# EAGLE design IA-prop-raspberry (EAGLE 6.6.0)
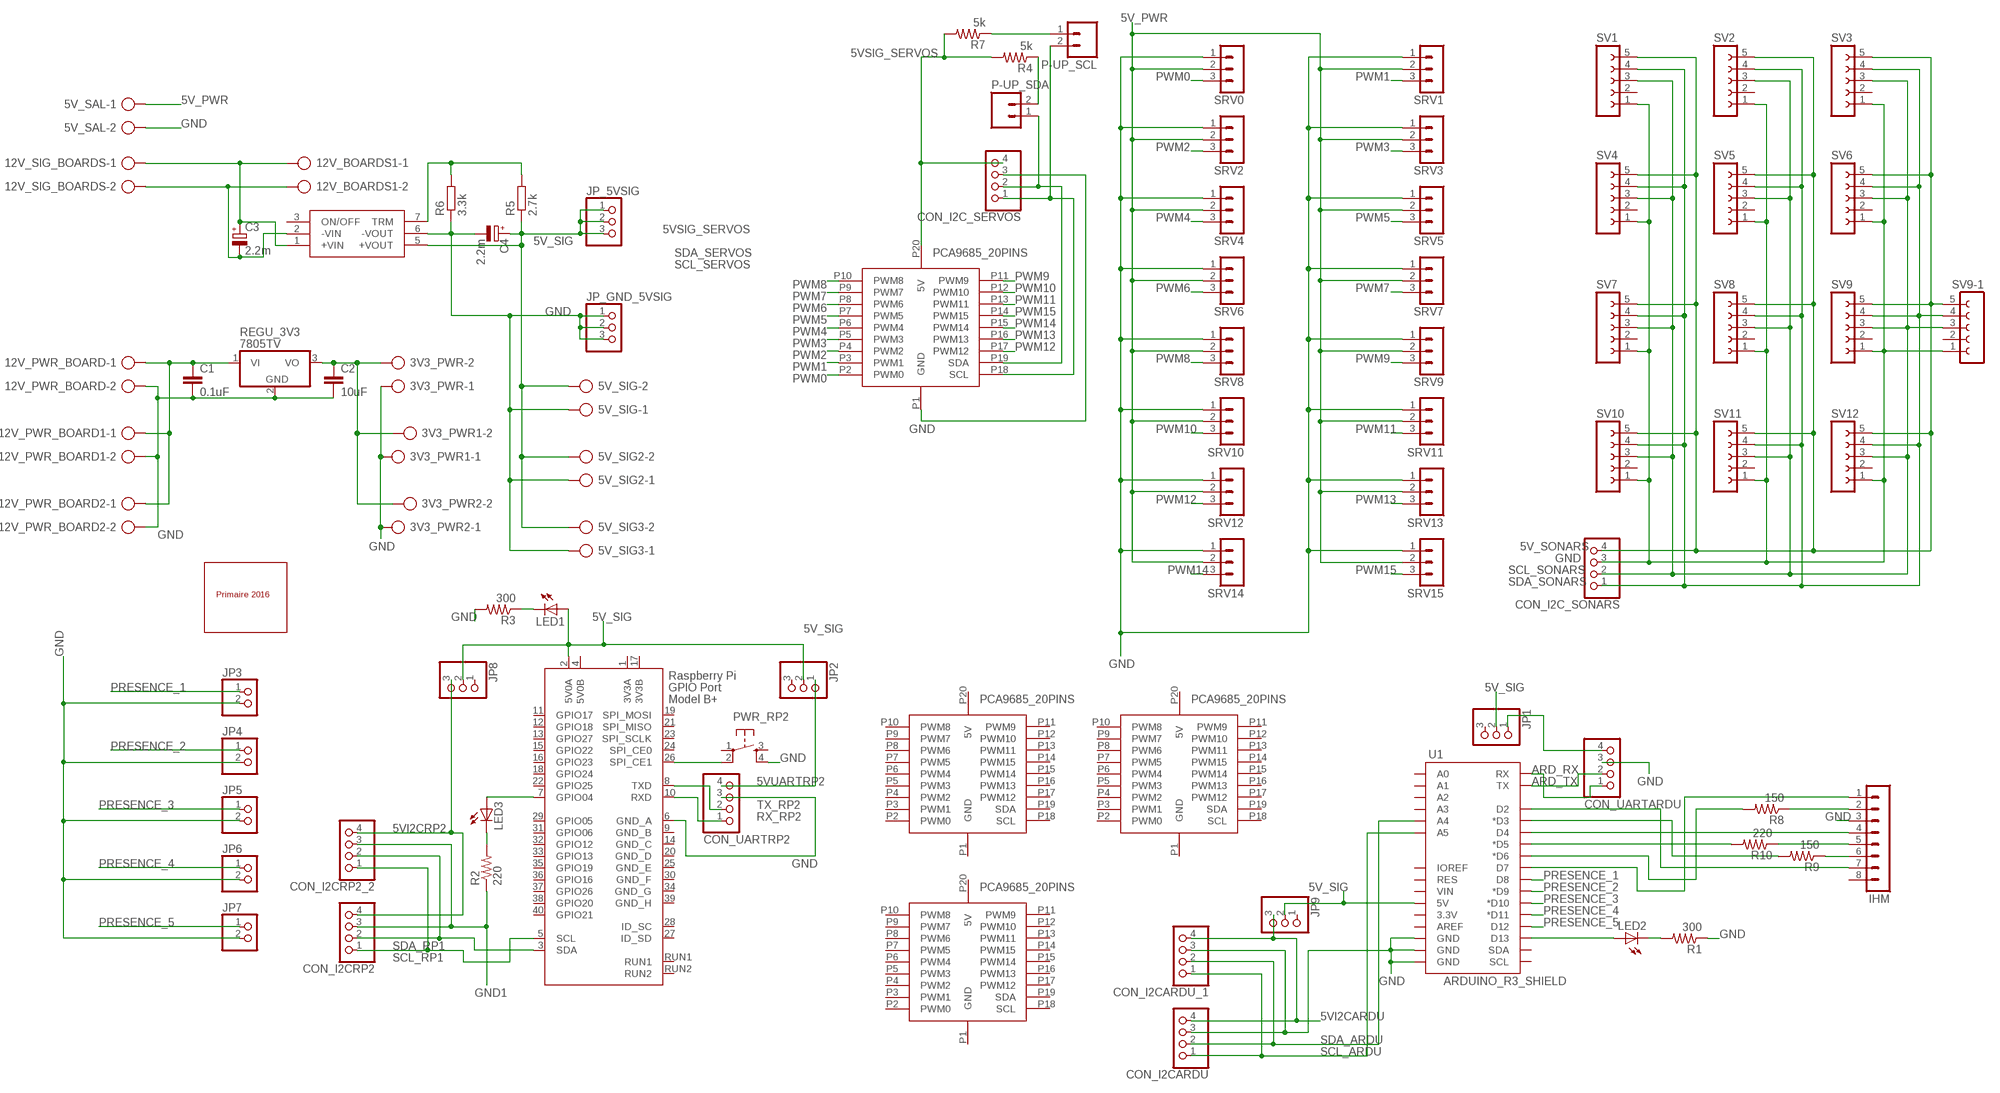
[diagram p0: schematic, sheet 1, part 1 of 2]
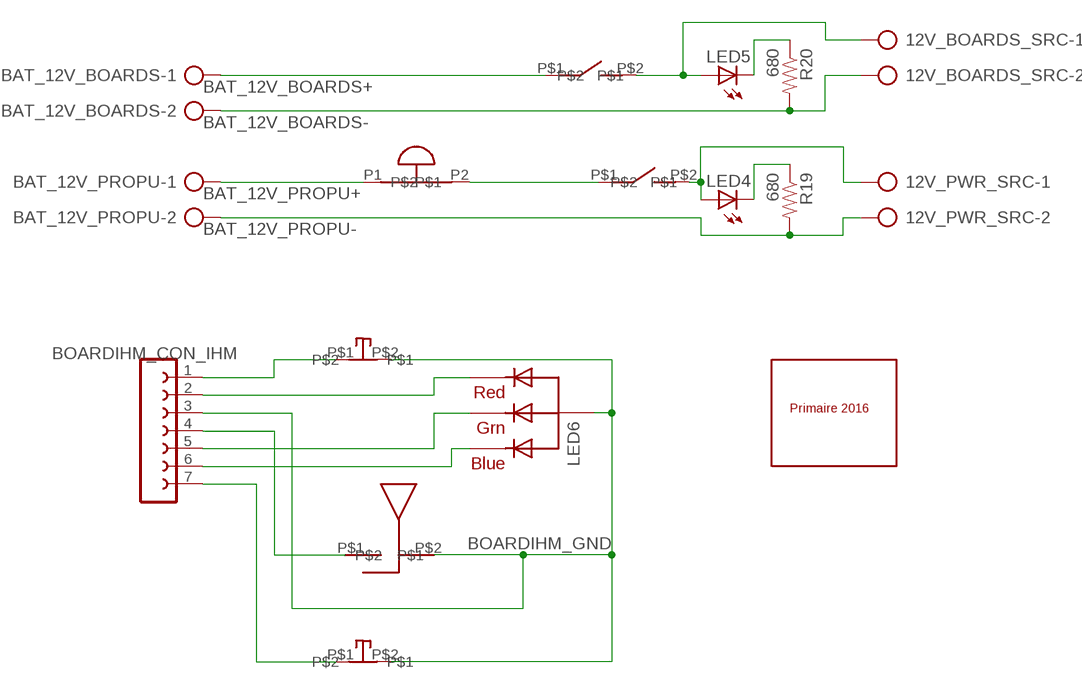
[diagram p1: schematic, sheet 1, part 2 of 2]

## Parts
3V3_PWR  AK300/2  [AK300/2]
3V3_PWR1  AK300/2  [AK300/2]
3V3_PWR2  AK300/2  [AK300/2]
5V_SAL  AK300/2  [AK300/2]
5V_SIG  AK300/2  [AK300/2]
5V_SIG2  AK300/2  [AK300/2]
5V_SIG3  AK300/2  [AK300/2]
12V_BOARDS1  AK300/2  [AK300/2]
12V_BOARDS_SRC  AK300/2  [AK300/2]
12V_PWR_BOARD  AK300/2  [AK300/2]
12V_PWR_BOARD1  AK300/2  [AK300/2]
12V_PWR_BOARD2  AK300/2  [AK300/2]
12V_PWR_SRC  AK300/2  [AK300/2]
12V_SIG_BOARDS  AK300/2  [AK300/2]
BAT_12V_BOARDS  AK300/2  [AK300/2]
BAT_12V_PROPU  AK300/2  [AK300/2]
BOARDIHM_CON_IHM  FE07-1  [FE07]
C1  0.1uF  C-EU050-025X075  [C050-025X075]
C2  10uF  C-EU050-025X075  [C050-025X075]
C3  2.2m  CPOL-EUE5-13  [E5-13]
C4  2.2m  CPOL-EUE5-13  [E5-13]
CON_I2C_SERVOS  PINHD-1X4  [1X04]
CON_I2C_SONARS  PINHD-1X4  [1X04]
CON_I2CARDU  PINHD-1X4  [1X04]
CON_I2CARDU_1  PINHD-1X4  [1X04]
CON_I2CRP2  PINHD-1X4  [1X04]
CON_I2CRP2_2  PINHD-1X4  [1X04]
CON_UARTARDU  PINHD-1X4  [1X04]
CON_UARTRP2  PINHD-1X4  [1X04]
IHM  MA08-1  [MA08-1]
JP1  PINHD-1X3  [1X03]
JP2  PINHD-1X3  [1X03]
JP3  PINHD-1X2  [1X02]
JP4  PINHD-1X2  [1X02]
JP5  PINHD-1X2  [1X02]
JP6  PINHD-1X2  [1X02]
JP7  PINHD-1X2  [1X02]
JP8  PINHD-1X3  [1X03]
JP9  PINHD-1X3  [1X03]
JP_5VSIG  PINHD-1X3  [1X03]
JP_GND_5VSIG  PINHD-1X3  [1X03]
LED1  LED3MM  [LED3MM]
LED2  LED3MM  [LED3MM]
LED3  LED3MM  [LED3MM]
LED4  LED5MM  [LED5MM]
LED5  LED5MM  [LED5MM]
LED6  RGBLED_CA-5MM  [LED5MMRGB]
P-UP_SCL  M02PTH  [1X02]
P-UP_SDA  M02PTH  [1X02]
PWR_RP2  TAC_SWITCHPTH  [TACTILE-PTH]
R1  300  RESISTORAXIAL-0.3  [AXIAL-0.3]
R2  220  RESISTORAXIAL-0.3  [AXIAL-0.3]
R3  300  RESISTORAXIAL-0.3  [AXIAL-0.3]
R4  5k  RESISTORAXIAL-0.3  [AXIAL-0.3]
R5  2.7k  R-EU_0207/7  [0207/7]
R6  3.3k  R-EU_0207/7  [0207/7]
R7  5k  RESISTORAXIAL-0.3  [AXIAL-0.3]
R8  150  RESISTORAXIAL-0.3  [AXIAL-0.3]
R9  150  RESISTORAXIAL-0.3  [AXIAL-0.3]
R10  220  RESISTORAXIAL-0.3  [AXIAL-0.3]
R19  680  RESISTORAXIAL-0.3  [AXIAL-0.3]
R20  680  RESISTORAXIAL-0.3  [AXIAL-0.3]
REGU_3V3  7805TV  [TO220V]
RP2  RASPI_BOARD_B+#_FP  [RASPI_BOARD_B+_FULL_PAD]
SRV0  MA03-1  [MA03-1]
SRV1  MA03-1  [MA03-1]
SRV2  MA03-1  [MA03-1]
SRV3  MA03-1  [MA03-1]
SRV4  MA03-1  [MA03-1]
SRV5  MA03-1  [MA03-1]
SRV6  MA03-1  [MA03-1]
SRV7  MA03-1  [MA03-1]
SRV8  MA03-1  [MA03-1]
SRV9  MA03-1  [MA03-1]
SRV10  MA03-1  [MA03-1]
SRV11  MA03-1  [MA03-1]
SRV12  MA03-1  [MA03-1]
SRV13  MA03-1  [MA03-1]
SRV14  MA03-1  [MA03-1]
SRV15  MA03-1  [MA03-1]
SV1  FE05-1  [FE05-1]
SV2  FE05-1  [FE05-1]
SV3  FE05-1  [FE05-1]
SV4  FE05-1  [FE05-1]
SV5  FE05-1  [FE05-1]
SV6  FE05-1  [FE05-1]
SV7  FE05-1  [FE05-1]
SV8  FE05-1  [FE05-1]
SV9  FE05-1  [FE05-1]
SV9-1  FE05-1  [FE05-1]
SV10  FE05-1  [FE05-1]
SV11  FE05-1  [FE05-1]
SV12  FE05-1  [FE05-1]
U1  ARDUINO_R3_SHIELD  [UNO_R3_SHIELD]
U$1  PCA9685_FEMALE  [2X10PINS_SPACE10MM]
U$2  TEN25-1211TEN25-1211  [TEN25]
U$3  FOOTPRINT_PRIMAIRE2016  [PRIMAIRE2016]
U$4  BAU  [BAU_30]
U$5  PCA9685_MALE  [TSSOP28_&_2X10PINS_SPACE10MM]
U$6  SWITCH_01  [SWITCH_01]
U$7  PCA9685_MALE  [TSSOP28_&_2X10PINS_SPACE10MM]
U$8  SWITCH_01  [SWITCH_01]
U$9  PUSH_BUT_COL_SELEC  [PUSH_BUT_COL_SELEC]
U$10  CORD  [CORD]
U$11  FOOTPRINT_PRIMAIRE2016  [PRIMAIRE2016]
U$12  PUSH_BUT_COL_SELEC  [PUSH_BUT_COL_SELEC]
U$13  PCA9685_MALE  [TSSOP28_&_2X10PINS_SPACE10MM]

## Nets
5V_PRP1: LED2.A U1.D13
5V_PWR: 5V_SAL.1 SRV0.2 SRV1.2 SRV2.2 SRV3.2 SRV4.2 SRV5.2 SRV6.2 SRV7.2 SRV8.2 SRV9.2 SRV10.2 SRV11.2 SRV12.2 SRV13.2 SRV14.2 SRV15.2
5V_SIG: 5V_SIG2.2 5V_SIG3.2 5V_SIG.2 C4.+ JP1.2 JP2.2 JP8.2 JP9.2 JP_5VSIG.1 JP_5VSIG.2 JP_5VSIG.3 LED1.A R5.1 RP2.2(5V0A) U1.5V U$2.5(+VOUT)
5V_SONARS: CON_I2C_SONARS.4 SV1.5 SV2.5 SV3.5 SV4.5 SV5.5 SV6.5 SV7.5 SV8.5 SV9-1.5 SV9.5 SV10.5 SV11.5 SV12.5
5VI2CARDU: CON_I2CARDU.4 CON_I2CARDU_1.4 JP9.3
5VI2CRP2: CON_I2CRP2.4 CON_I2CRP2_2.4 JP8.3
5VSIG_SERVOS: CON_I2C_SERVOS.4 R4.P$2 R7.P$2 U$1.P20(5V)
5VUARTRP2: CON_UARTRP2.4 JP2.1
+12V: 12V_BOARDS1.1 12V_SIG_BOARDS.1 C3.+ U$2.1(+VIN)
ARD_RX: CON_UARTARDU.1 U1.RX
ARD_TX: CON_UARTARDU.2 U1.TX
BAT_12V_BOARDS+: BAT_12V_BOARDS.1 U$8.P$1
BAT_12V_BOARDS-: 12V_BOARDS_SRC.2 BAT_12V_BOARDS.2 R20.P$2
BAT_12V_PROPU+: BAT_12V_PROPU.1 U$4.P1
BAT_12V_PROPU-: 12V_PWR_SRC.2 BAT_12V_PROPU.2 R19.P$2
BOARDIHM_GND: BOARDIHM_CON_IHM.3 LED6.2(VCC) U$9.P$2 U$10.P$2 U$12.P$2
GND: 3V3_PWR1.1 3V3_PWR2.1 3V3_PWR.1 5V_SAL.2 5V_SIG2.1 5V_SIG3.1 5V_SIG.1 12V_PWR_BOARD1.2 12V_PWR_BOARD2.2 12V_PWR_BOARD.2 C1.2 C2.2 C4.- CON_I2C_SERVOS.3 CON_I2C_SONARS.3 CON_I2CARDU.3 CON_I2CARDU_1.3 CON_UARTARDU.3 CON_UARTRP2.3 IHM.3 JP3.2 JP4.2 JP5.2 JP6.2 JP7.2 JP_GND_5VSIG.1 JP_GND_5VSIG.2 JP_GND_5VSIG.3 PWR_RP2.4 R1.P$1 R3.P$2 R6.1 REGU_3V3.2(GND) RP2.6(GND_A) SRV0.1 SRV1.1 SRV2.1 SRV3.1 SRV4.1 SRV5.1 SRV6.1 SRV7.1 SRV8.1 SRV9.1 SRV10.1 SRV11.1 SRV12.1 SRV13.1 SRV14.1 SRV15.1 SV1.1 SV2.1 SV3.1 SV4.1 SV5.1 SV6.1 SV7.1 SV8.1 SV9-1.1 SV9.1 SV10.1 SV11.1 SV12.1 U1.GND@0(GND) U1.GND@1(GND) U1.GND@2(GND) U$1.P1(GND) U$2.6(-VOUT)
GND1: CON_I2CRP2.3 CON_I2CRP2_2.3 R2.P$1
GND_12: 12V_BOARDS1.2 12V_SIG_BOARDS.2 C3.- U$2.2(-VIN)
N$1: CON_UARTARDU.4 JP1.1
N$2: LED2.K(C) R1.P$2
N$3: LED3.K(C) R2.P$2
N$4: R5.2 R6.2 U$2.7(TRM)
N$5: P-UP_SDA.2 R4.P$1
N$6: BOARDIHM_CON_IHM.1 U$9.P$1
N$7: LED1.K(C) R3.P$1
N$8: U$4.P2 U$6.P$1
N$9: P-UP_SCL.1 R7.P$1
N$12: LED4.K(C) R19.P$1
N$14: 12V_BOARDS_SRC.1 LED5.A U$8.P$2
N$15: BOARDIHM_CON_IHM.2 LED6.1(RED)
N$16: LED5.K(C) R20.P$1
N$17: R9.P$2 U1.D3(*D3)
N$18: BOARDIHM_CON_IHM.4 U$10.P$1
N$39: R10.P$2 U1.D5(*D5)
N$40: 12V_PWR_SRC.1 LED4.A U$6.P$2
N$41: IHM.6 R9.P$1
N$42: LED3.A RP2.7(GPIO04)
N$43: IHM.5 R10.P$1
N$44: IHM.2 R8.P$1
N$45: R8.P$2 U1.D6(*D6)
N$46: IHM.1 U1.D7
N$47: IHM.4 U1.D4
N$49: IHM.7 U1.D2
N$51: BOARDIHM_CON_IHM.5 LED6.3(GREEN)
N$52: BOARDIHM_CON_IHM.6 LED6.4(BLUE)
N$72: 3V3_PWR1.2 3V3_PWR2.2 3V3_PWR.2 C2.1 REGU_3V3.3(VO)
N$73: BOARDIHM_CON_IHM.7 U$12.P$1
N$74: 12V_PWR_BOARD1.1 12V_PWR_BOARD2.1 12V_PWR_BOARD.1 C1.1 REGU_3V3.1(VI)
PRESENCE_1: JP3.1 U1.D8
PRESENCE_2: JP4.1 U1.D9(*D9)
PRESENCE_3: JP5.1 U1.D10(*D10)
PRESENCE_4: JP6.1 U1.D11(*D11)
PRESENCE_5: JP7.1 U1.D12
PWM0: SRV0.3 U$1.P2(PWM0)
PWM1: SRV1.3 U$1.P3(PWM1)
PWM2: SRV2.3 U$1.P4(PWM2)
PWM3: SRV3.3 U$1.P5(PWM3)
PWM4: SRV4.3 U$1.P6(PWM4)
PWM5: SRV5.3 U$1.P7(PWM5)
PWM6: SRV6.3 U$1.P8(PWM6)
PWM7: SRV7.3 U$1.P9(PWM7)
PWM8: SRV8.3 U$1.P10(PWM8)
PWM9: SRV9.3 U$1.P11(PWM9)
PWM10: SRV10.3 U$1.P12(PWM10)
PWM11: SRV11.3 U$1.P13(PWM11)
PWM12: SRV12.3 U$1.P17(PWM12)
PWM13: SRV13.3 U$1.P16(PWM13)
PWM14: SRV14.3 U$1.P15(PWM14)
PWM15: SRV15.3 U$1.P14(PWM15)
RP2_PWR: PWR_RP2.2 RP2.26(SPI_CE1)
RX_RP2: CON_UARTRP2.1 RP2.10(RXD)
SCL_ARDU: CON_I2CARDU.1 CON_I2CARDU_1.1 U1.A5
SCL_RP1: CON_I2CRP2.1 CON_I2CRP2_2.1 RP2.5(SCL)
SCL_SERVOS: CON_I2C_SERVOS.1 P-UP_SCL.2 U$1.P18(SCL)
SCL_SONARS: CON_I2C_SONARS.2 SV1.3 SV2.3 SV3.3 SV4.3 SV5.3 SV6.3 SV7.3 SV8.3 SV9-1.3 SV9.3 SV10.3 SV11.3 SV12.3
SDA_ARDU: CON_I2CARDU.2 CON_I2CARDU_1.2 U1.A4
SDA_RP1: CON_I2CRP2.2 CON_I2CRP2_2.2 RP2.3(SDA)
SDA_SERVOS: CON_I2C_SERVOS.2 P-UP_SDA.1 U$1.P19(SDA)
SDA_SONARS: CON_I2C_SONARS.1 SV1.4 SV2.4 SV3.4 SV4.4 SV5.4 SV6.4 SV7.4 SV8.4 SV9-1.4 SV9.4 SV10.4 SV11.4 SV12.4
TX_RP2: CON_UARTRP2.2 RP2.8(TXD)
Unconnected: IHM.8 JP1.3 JP2.3 JP8.1 JP9.1 PWR_RP2.1 PWR_RP2.3 RP2.11(GPIO17) RP2.12(GPIO18) RP2.13(GPIO27) RP2.15(GPIO22) RP2.16(GPIO23) RP2.18(GPIO24) RP2.19(SPI_MOSI) RP2.21(SPI_MISO) RP2.22(GPIO25) RP2.23(SPI_SCLK) RP2.24(SPI_CE0) RP2.27(ID_SD) RP2.28(ID_SC) RP2.29(GPIO05) RP2.31(GPIO06) RP2.32(GPIO12) RP2.33(GPIO13) RP2.35(GPIO19) RP2.36(GPIO16) RP2.37(GPIO26) RP2.38(GPIO20) RP2.40(GPIO21) RP2.RUN1 RP2.RUN2 SV1.2 SV2.2 SV3.2 SV4.2 SV5.2 SV6.2 SV7.2 SV8.2 SV9-1.2 SV9.2 SV10.2 SV11.2 SV12.2 U1.3.3V U1.A0 U1.A1 U1.A2 U1.A3 U1.AREF U1.IOREF U1.RES U1.SCL U1.SDA U1.VIN U$2.3(ON/OFF) U$5.P1(GND) U$5.P2(PWM0) U$5.P3(PWM1) U$5.P4(PWM2) U$5.P5(PWM3) U$5.P6(PWM4) U$5.P7(PWM5) U$5.P8(PWM6) U$5.P9(PWM7) U$5.P10(PWM8) U$5.P11(PWM9) U$5.P12(PWM10) U$5.P13(PWM11) U$5.P14(PWM15) U$5.P15(PWM14) U$5.P16(PWM13) U$5.P17(PWM12) U$5.P18(SCL) U$5.P19(SDA) U$5.P20(5V) U$7.P1(GND) U$7.P2(PWM0) U$7.P3(PWM1) U$7.P4(PWM2) U$7.P5(PWM3) U$7.P6(PWM4) U$7.P7(PWM5) U$7.P8(PWM6) U$7.P9(PWM7) U$7.P10(PWM8) U$7.P11(PWM9) U$7.P12(PWM10) U$7.P13(PWM11) U$7.P14(PWM15) U$7.P15(PWM14) U$7.P16(PWM13) U$7.P17(PWM12) U$7.P18(SCL) U$7.P19(SDA) U$7.P20(5V) U$13.P1(GND) U$13.P2(PWM0) U$13.P3(PWM1) U$13.P4(PWM2) U$13.P5(PWM3) U$13.P6(PWM4) U$13.P7(PWM5) U$13.P8(PWM6) U$13.P9(PWM7) U$13.P10(PWM8) U$13.P11(PWM9) U$13.P12(PWM10) U$13.P13(PWM11) U$13.P14(PWM15) U$13.P15(PWM14) U$13.P16(PWM13) U$13.P17(PWM12) U$13.P18(SCL) U$13.P19(SDA) U$13.P20(5V)

## Power pins joined to a net without a drawn wire
3V3A: RP2.1(3V3A)
3V3B: RP2.17(3V3B)
5V0B: RP2.4(5V0B)
GND_B: RP2.9(GND_B)
GND_C: RP2.14(GND_C)
GND_D: RP2.20(GND_D)
GND_E: RP2.25(GND_E)
GND_F: RP2.30(GND_F)
GND_G: RP2.34(GND_G)
GND_H: RP2.39(GND_H)

## Library data of the parts
3V3_PWR 3V3_PWR1 3V3_PWR2 5V_SAL 5V_SIG 5V_SIG2 5V_SIG3 12V_BOARDS1 12V_BOARDS_SRC 12V_PWR_BOARD 12V_PWR_BOARD1 12V_PWR_BOARD2 12V_PWR_SRC 12V_SIG_BOARDS BAT_12V_BOARDS BAT_12V_PROPU = con-ptr500:AK300/2: CONNECTOR; OC_FARNELL: unknown; OC_NEWARK: unknown
BOARDIHM_CON_IHM = con-lsta:FE07-1: FEMALE HEADER; OC_FARNELL: unknown; OC_NEWARK: unknown
C1 C2 = rcl:C-EU: CAPACITOR, European symbol
C3 C4 = resistor:CPOL-EU: POLARIZED CAPACITOR, European symbol
CON_I2C_SERVOS CON_I2C_SONARS CON_I2CARDU CON_I2CARDU_1 CON_I2CRP2 CON_I2CRP2_2 CON_UARTARDU CON_UARTRP2 = pinhead:PINHD-1X4: PIN HEADER
IHM = con-lstb:MA08-1: PIN HEADER
JP1 JP2 JP8 JP9 JP_5VSIG JP_GND_5VSIG = pinhead:PINHD-1X3: PIN HEADER
JP3-JP7 = pinhead:PINHD-1X2: PIN HEADER
LED1-LED3 = SparkFun:LED: LEDs Standard schematic elements and footprints for 5mm, 3mm, 1206, and 0603 sized LEDs. 5mm - Spark Fun Electronics SKU : COM-00529 (and others)
LED4 LED5 = adafruit:LED: LED OSRAM: - CHIPLED LG R971, LG N971, LY N971, LG Q971, LY Q971, LO R971, LY R971 LH N974, LH R974 LS Q976, LO Q976, LY Q976 LO Q996 - Hyper CHIPLED LW Q18S LB Q993, LB Q99A, LB R99A - SideLED LS A670, LO A670, LY A670, LG A670, LP A670 LB A673, LV A673, LT A673, LW A673 LH A674 LY A675 LS A676, LA A676, LO A676, LY A676, LW A676 LS A679, LY A679, LG A679 - Hyper Micro SIDELED® LS Y876, LA Y876, LO Y876, LY Y876 LT Y87S - SmartLED LW L88C, LW L88S LB L89C, LB L89S, LG L890 LS L89K, LO L89K, LY L89K LS L896, LA L896, LO L896, LY L896 - TOPLED LS T670, LO T670, LY T670, LG T670, LP T670 LSG T670, LSP T670, LSY T670, LOP T670, LYG T670 LG T671, LOG T671, LSG T671 LB T673, LV T673, LT T673, LW T673 LH T674 LS T676, LA T676, LO T676, LY T676, LB T676, LH T676, LSB T676, LW T676 LB T67C, LV T67C, LT T67C, LS T67K, LO T67K, LY T67K, LW E67C LS E67B, LA E67B, LO E67B, LY E67B, LB E67C, LV E67C, LT E67C LW T67C LS T679, LY T679, LG T679 LS T770, LO T770, LY T770, LG T770, LP T770 LB T773, LV T773, LT T773, LW T773 LH T774 LS E675, LA E675, LY E675, LS T675 LS T776, LA T776, LO T776, LY T776, LB T776 LHGB T686 LT T68C, LB T68C - Hyper Mini TOPLED® LB M676 - Mini TOPLED Santana® LG M470 LS M47K, LO M47K, LY M47K Source: http://www.osram.convergy.de/
LED6 = adafruit:RGBLED_CA: RGB LED, common-anode 5MM Staggered pins 5mm Piranha package http://www.ladyada.net/library/pcb/eaglelibrary.html
P-UP_SCL P-UP_SDA = SparkFun:M02: Header 2 Standard 2-pin 0.1" header. Use with straight break away headers (SKU : PRT-00116), right angle break away headers (PRT-00553), swiss pins (PRT-00743), machine pins (PRT-00117), and female headers (PRT-00115). Molex polarized connector foot print use with SKU : PRT-08233 with associated crimp pins and housings.
PWR_RP2 = SparkFun:TAC_SWITCH: Momentary Switch Button commonly used for reset or general input. Spark Fun Electronics SKU : COM-00097
R1-R4 R7-R10 R19 R20 = SparkFun:RESISTOR: Resistor Basic schematic elements and footprints for 0603, 1206, and PTH resistors.
R5 R6 = resistor:R-EU_: RESISTOR, European symbol
REGU_3V3 = linear:78*: Positive VOLTAGE REGULATOR Source: http://cache.national.com/ds/LM/LM78L05.pdf http://www.fairchildsemi.com/ds/LM/LM7805.pdf
RP2 = raspberrypi_bastelstube_v13-enac:RASPI_BOARD_B+#: Raspberry Pi GPIO connector with markings for the outer dimensions of the Raspberry Pi board model B+ with different sets of drill holes or mounting pads All pins connected
SRV0 SRV1-SRV15 = con-lstb:MA03-1: PIN HEADER
SV1-SV9 SV9-1 SV10-SV12 = con-lsta:FE05-1: FEMALE HEADER; OC_FARNELL: unknown; OC_NEWARK: unknown
U1 = SparkFun-Boards:ARDUINO_R3_SHIELD: Shield form compatible with the Arduino Uno R3.
U$1 = club:PCA9685_FEMALE: PCA9685_20PINS_FEMALE
U$2 = tracopower:TEN25-1211
U$3 U$11 = footprintPrimaire2016:FOOTPRINT_PRIMAIRE2016
U$4 = club:BAU
U$5 U$7 U$13 = club:PCA9685_MALE: PCA9685_20PINS_MALE
U$6 U$8 = club:SWITCH_01
U$9 U$12 = club:PUSH_BUT_COL_SELEC
U$10 = club:CORD

## Board
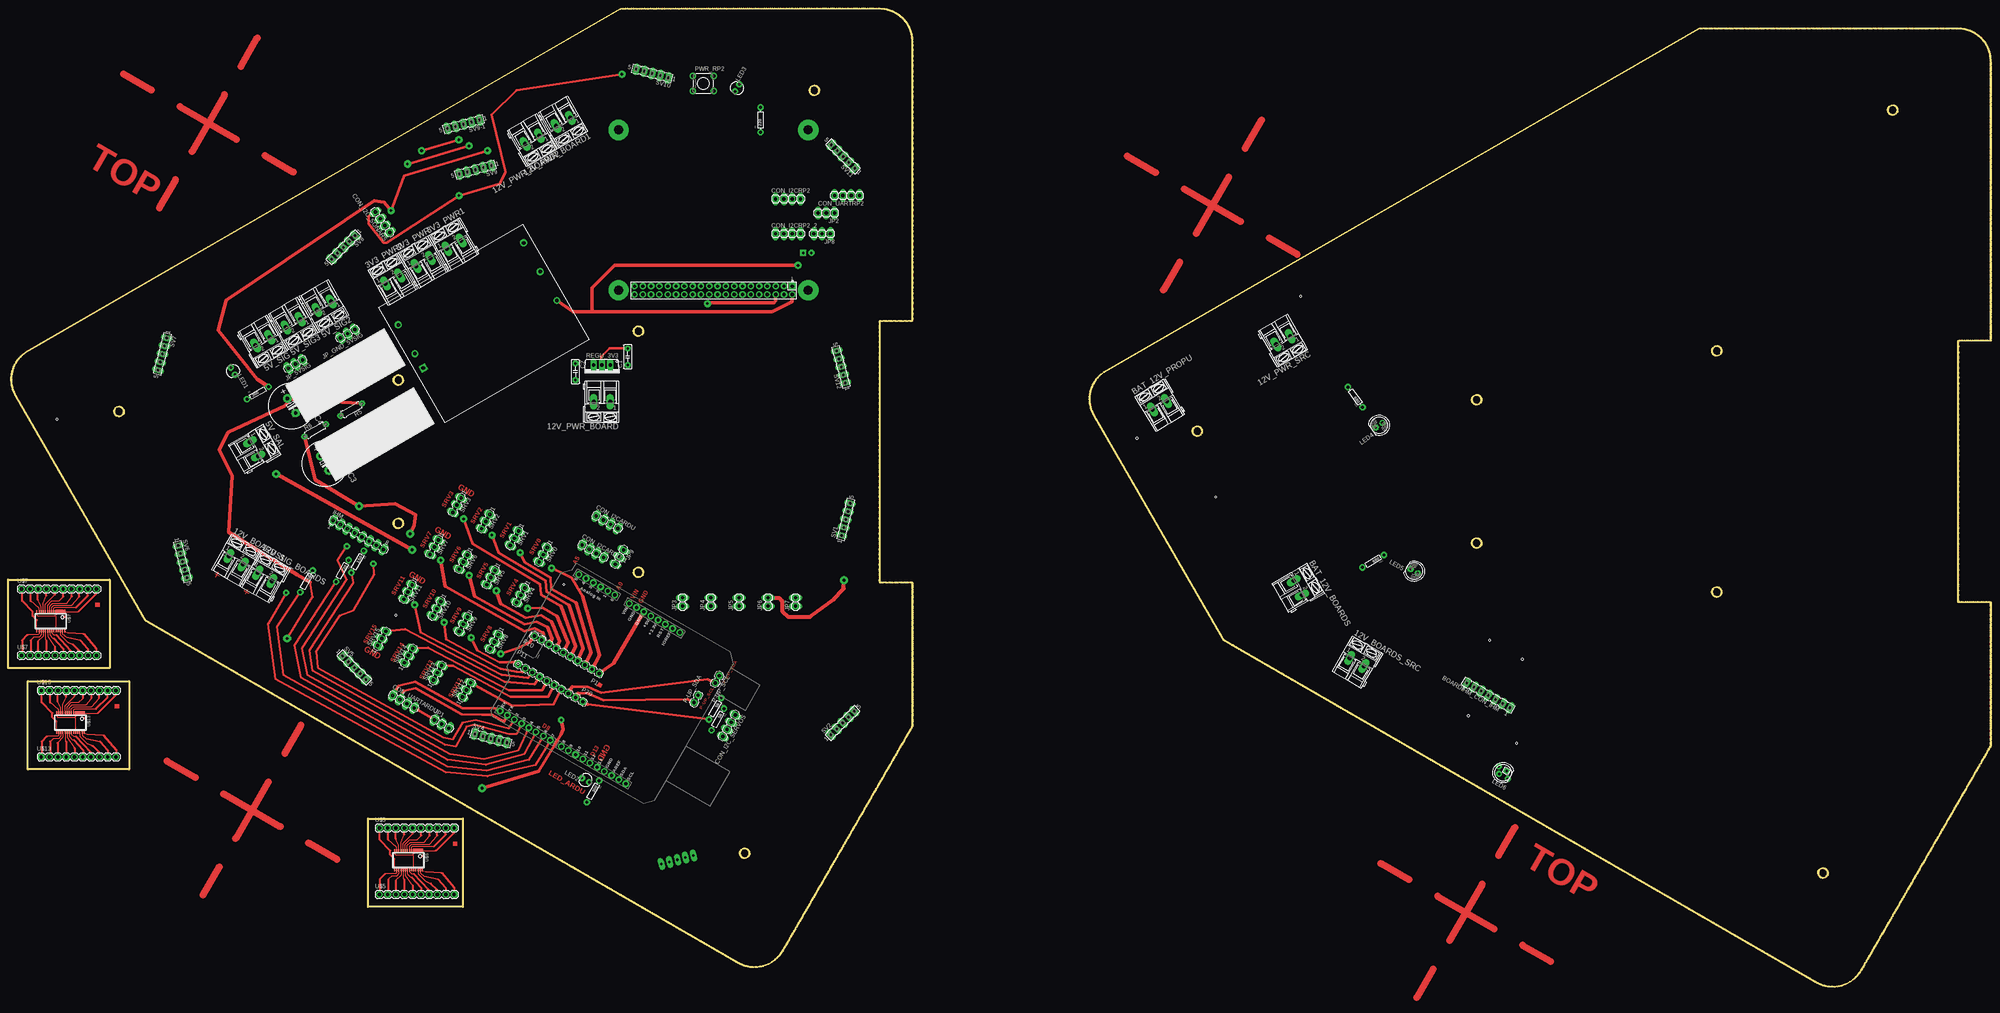
[diagram p2: board, top side]
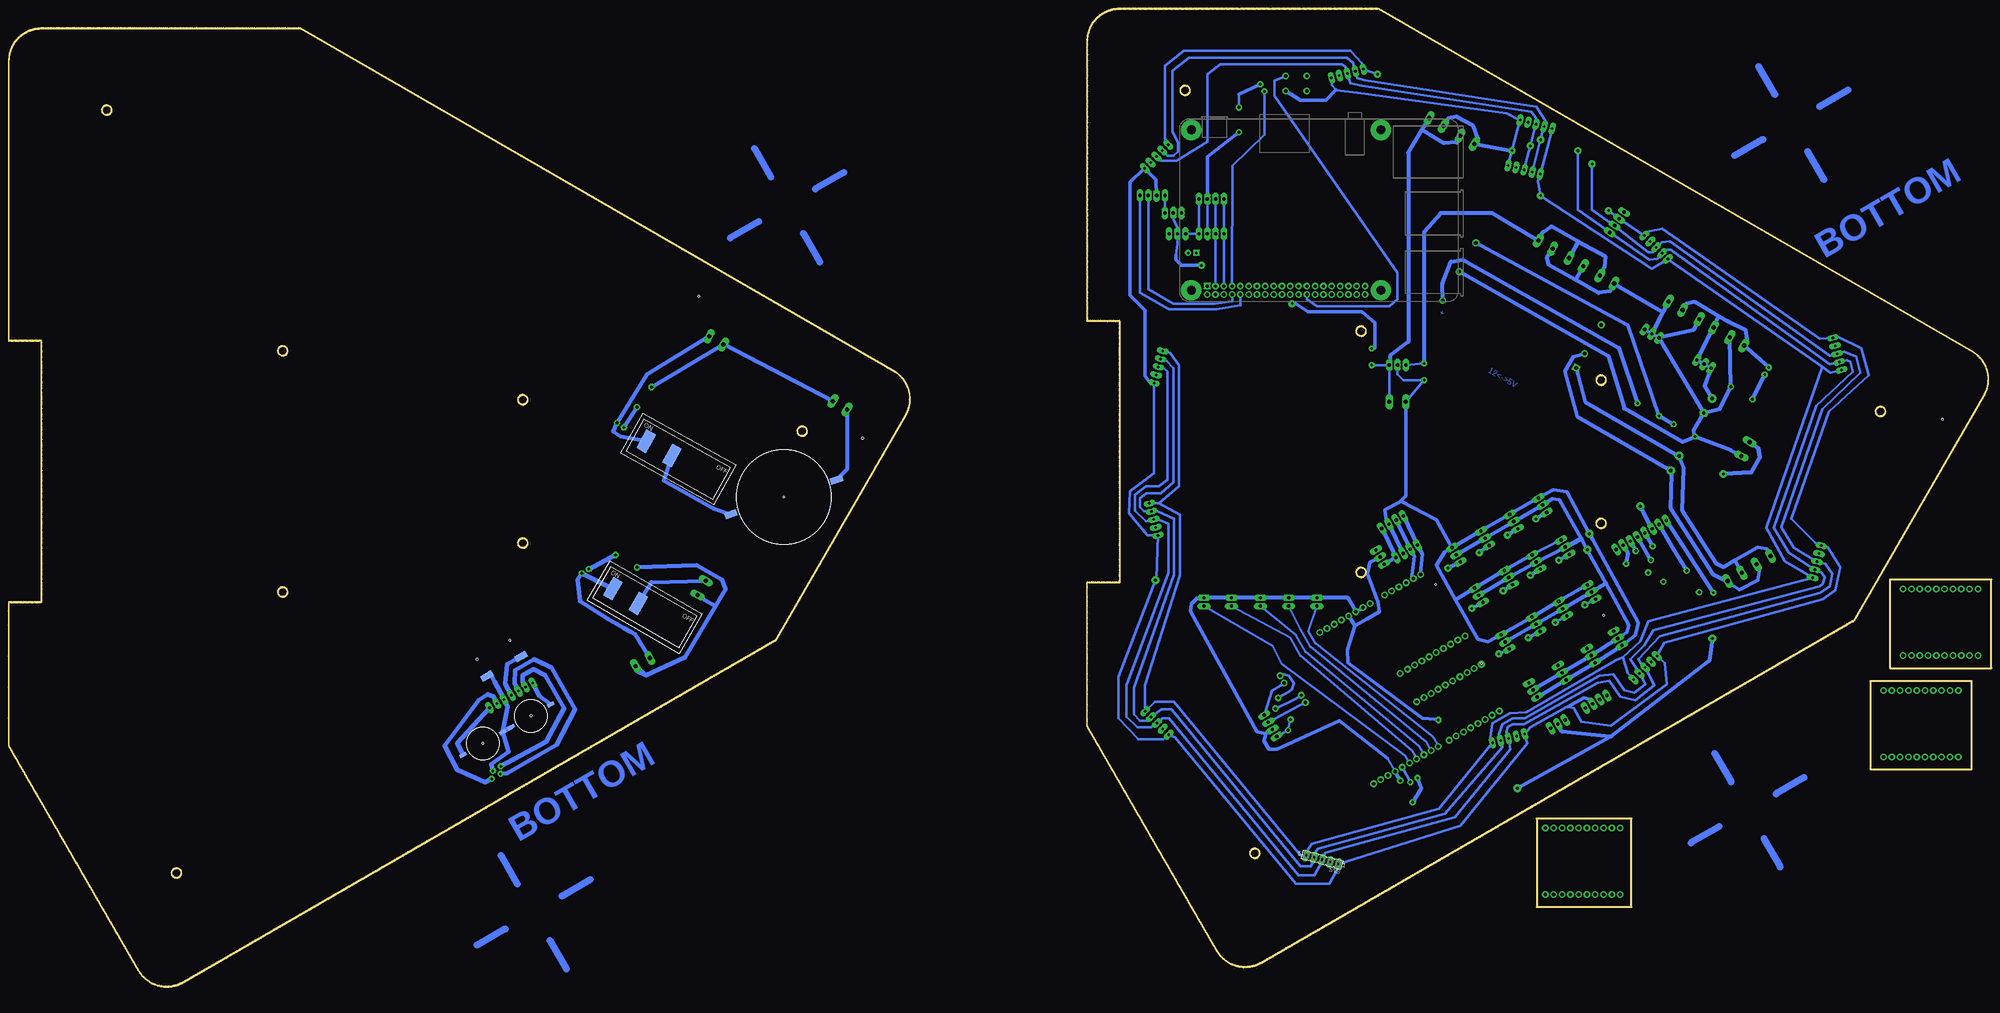
[diagram p3: board, bottom side, seen from below]

Size 606.3 x 299.27 mm. Coordinates in mm from the lower left corner, seen from the top.
Outline: 110,51.58 139,51.58 139,24.58 110,24.58 110,51.58
Outline: 6,93.58 37,93.58 37,66.58 6,66.58 6,93.58
Outline: 0,124.58 31,124.58 31,97.58 0,97.58 0,124.58
Copper layers (1*16): Top 0.035mm / dielectric 1.5mm / Bottom 0.035mm
Design rules: minimum track width 10mil, minimum drill 10mil, track to track 15mil, track to pad 15mil, pad to pad 15mil, via to via 15mil, smd to smd 8mil, copper to edge 40mil, drill to drill 8mil, minimum pad ring 15mil, minimum via ring 8mil, stop-mask expansion 4mil, vias tented up to drill 0mil, thermal gap 10mil
Holes 0.6 mm at 155.88,98.98 169.85,123.11 118.54,113.72 14.91,173.66 345.11,167.82 395.15,211.25

### Footprints (pad centres in the part's own frame; a part is rotated, then mirrored left to right if it is on the bottom)
AK300/2 = drill 1.321 long: 1 -2.515,0; 2 2.489,0
FE07 = drill 0.813 long: 1 -7.62,0; 2 -5.08,0; 3 -2.54,0; 4 0,0; 5 2.54,0; 6 5.08,0; 7 7.62,0
C050-025X075 = drill 0.813 octagon: 1 -2.54,0; 2 2.54,0
E5-13 = drill 1.016 pad 2.54: + -2.54,0 | drill 1.016 pad 2.54 octagon: - 2.54,0
1X04 = drill 1.016 long: 1 -3.81,0; 2 -1.27,0; 3 1.27,0; 4 3.81,0
MA08-1 = drill 1.016 long: 1 -8.89,0; 2 -6.35,0; 3 -3.81,0; 4 -1.27,0; 5 1.27,0; 6 3.81,0; 7 6.35,0; 8 8.89,0
1X03 = drill 1.016 long: 1 -2.54,0; 2 0,0; 3 2.54,0
1X02 = drill 1.016 long: 1 -1.27,0; 2 1.27,0
LED3MM = drill 0.813 pad 1.88: A -1.27,0; K 1.27,0
LED5MM = drill 0.813 pad 1.676 octagon: A -1.27,0; K 1.27,0
LED5MMRGB = drill 0.8 pad 1.676: 1 -2.159,0.968; 3 0.889,0.968; 4 2.159,-0.968 | drill 0.8 pad 1.676 octagon: 2 -0.635,-0.968
1X02' = drill 1.016 pad 1.88: 1 0,0; 2 2.54,0
TACTILE-PTH = drill 1.016 pad 1.88: 1 -3.251,2.261; 2 3.251,2.261; 3 -3.251,-2.261; 4 3.251,-2.261
AXIAL-0.3 = drill 0.9 pad 1.88: P$1 -3.81,0; P$2 3.81,0
0207/7 = drill 0.813 octagon: 1 -3.81,0; 2 3.81,0
TO220V = drill 1.016 long: 1 -2.54,-2.54; 2 0,-2.54; 3 2.54,-2.54
RASPI_BOARD_B+_FULL_PAD = drill 1 pad 1.778 square: 1 8.37,51.23 | drill 1 pad 1.778: 2 8.37,53.77; 3 10.91,51.23; 4 10.91,53.77; 5 13.45,51.23; 6 13.45,53.77; 7 15.99,51.23; 8 15.99,53.77; 9 18.53,51.23; 10 18.53,53.77; 11 21.07,51.23; 12 21.07,53.77; 13 23.61,51.23; 14 23.61,53.77; 15 26.15,51.23; 16 26.15,53.77; 17 28.69,51.23; 18 28.69,53.77; 19 31.23,51.23; 20 31.23,53.77; 21 33.77,51.23; 22 33.77,53.77; 23 36.31,51.23; 24 36.31,53.77; 25 38.85,51.23; 26 38.85,53.77; 27 41.39,51.23; 28 41.39,53.77; 29 43.93,51.23; 30 43.93,53.77; 31 46.47,51.23; 32 46.47,53.77; 33 49.01,51.23; 34 49.01,53.77; 35 51.55,51.23; 36 51.55,53.77; 37 54.09,51.23; 38 54.09,53.77; 39 56.63,51.23; 40 56.63,53.77 | drill 2.75 pad 6.2: DRILL_1 3.5,52.5; DRILL_2 61.5,52.5; DRILL_3 3.5,3.5; DRILL_4 61.5,3.5 | drill 0.8 square: RUN1 5.068,41.07 | drill 0.8: RUN2 2.528,41.07
MA03-1 = drill 1.016 long: 1 -2.54,0; 2 0,0; 3 2.54,0
FE05-1 = drill 0.813 long: 1 -5.08,0; 2 -2.54,0; 3 0,0; 4 2.54,0; 5 5.08,0
UNO_R3_SHIELD = drill 1.016 pad 1.88: 3.3V 50.8,26.67; 5V 50.8,29.21; A0 50.8,41.91; A1 50.8,44.45; A2 50.8,46.99; A3 50.8,49.53; A4 50.8,52.07; A5 50.8,54.61; AREF 2.54,15.24; D2 2.54,49.53; D3 2.54,46.99; D4 2.54,44.45; D5 2.54,41.91; D6 2.54,39.37; D7 2.54,36.83; D8 2.54,33.02; D9 2.54,30.48; D10 2.54,27.94; D11 2.54,25.4; D12 2.54,22.86; D13 2.54,20.32; GND@0 50.8,31.75; GND@1 50.8,34.29; GND@2 2.54,17.78; IOREF 50.8,21.59; NC 50.8,19.05; RES 50.8,24.13; RX 2.54,54.61; SCL 2.54,10.16; SDA 2.54,12.7; TX 2.54,52.07; VIN 50.8,36.83
2X10PINS_SPACE10MM = drill 1.016 pad 1.88: P1 0,-10; P2 2.54,-10; P3 5.08,-10; P4 7.62,-10; P5 10.16,-10; P6 12.7,-10; P7 15.24,-10; P8 17.78,-10; P9 20.32,-10; P10 22.86,-10; P11 22.86,0; P12 20.32,0; P13 17.78,0; P14 15.24,0; P15 12.7,0; P16 10.16,0; P17 7.62,0; P18 5.08,0; P19 2.54,0; P20 0,0
TEN25 = drill 1.1 pad 1.778 square: 1 0,0 | drill 1.1 pad 1.778: 2 0,5.08; 3 0,15.24; 5 45.72,-2.54; 6 45.72,7.62; 7 45.72,17.78
BAU_30 = smd 3.81 x 1.93: P1 -17,0; P2 17,0 | hole 0.6: 0,0
TSSOP28_&_2X10PINS_SPACE10MM = smd 0.305 x 0.991: 21 4.225,3.243; 22 3.575,3.243; 23 2.925,3.243; 24 2.275,3.243; 25 1.625,3.243; 26 0.975,3.243; 27 0.325,3.243; 28 -0.325,3.243; 29 -0.975,3.243; 30 -1.625,3.243; 31 -2.275,3.243; 32 -2.925,3.243; 33 -3.575,3.243; 34 -4.225,3.243; 35 -4.225,-2.593; 36 -3.575,-2.593; 37 -2.925,-2.593; 38 -2.275,-2.593; 39 -1.625,-2.593; 40 -0.975,-2.593; 41 -0.325,-2.593; 42 0.325,-2.593; 43 0.975,-2.593; 44 1.625,-2.593; 45 2.275,-2.593; 46 2.925,-2.593; 47 3.575,-2.593; 48 4.225,-2.593 | drill 1.016 pad 1.88: P1 13.97,10.16; P2 11.43,10.16; P3 8.89,10.16; P4 6.35,10.16; P5 3.81,10.16; P6 1.27,10.16; P7 -1.27,10.16; P8 -3.81,10.16; P9 -6.35,10.16; P10 -8.89,10.16; P11 -8.89,-10.16; P12 -6.35,-10.16; P13 -3.81,-10.16; P14 -1.27,-10.16; P15 1.27,-10.16; P16 3.81,-10.16; P17 6.35,-10.16; P18 8.89,-10.16; P19 11.43,-10.16; P20 13.97,-10.16 | smd 3 x 1: P$1 2.925,3.25
SWITCH_01 = smd 3.251 x 6.452: P$1 13,5.5; P$2 4,5.5
PUSH_BUT_COL_SELEC = smd 2.184 x 1.067: P$1 -7,0; P$2 7,0 | hole 0.6: 0,0
CORD = smd 3.81 x 1.93: P$1 4,10.5; P$2 16,10.5 | hole 0.6: 4.5,4.5; 16,4.5

### Placement (x,y rotation side)
3V3_PWR  126.93,221.67 30 top
3V3_PWR1  136.32,227 30 top
3V3_PWR2  117.53,216.33 30 top
5V_SAL  75.18,164.54 300 top
5V_SIG  77.79,197.42 210 top
5V_SIG2  96.54,208.31 210 top
5V_SIG3  87.09,202.92 210 top
12V_BOARDS1  69.66,130.53 330 top
12V_BOARDS_SRC  412.32,99.4 330 top
12V_PWR_BOARD  181.54,178.99 180 top
12V_PWR_BOARD1  169.69,264.46 210 top
12V_PWR_BOARD2  160.2,259 210 top
12V_PWR_SRC  389.78,197.72 210 top
12V_SIG_BOARDS  78.46,125.45 330 top
BAT_12V_BOARDS  394.28,122.07 300 top
BAT_12V_PROPU  352.01,177.85 31 top
BOARDIHM_CON_IHM  452.51,89.25 150 top
C1  189.41,192.71 90 top
C2  173.41,188.14 270 top
C3  96.77,160.15 300 top
C4  86.61,177.74 300 top
CON_I2C_SERVOS  220.4,79.93 240 top
CON_I2C_SONARS  114.48,233.86 125 top
CON_I2CARDU  183.06,142.16 330 top
CON_I2CARDU_1  178.74,133.27 330 top
CON_I2CRP2  238.43,240.97 0 top
CON_I2CRP2_2  238.43,230.3 0 top
CON_UARTARDU  120.83,87.3 330 top
CON_UARTRP2  256.47,241.99 180 top
IHM  107.04,138.26 330 top
JP1  132.51,80.44 330 top
JP2  250.12,236.65 180 top
JP3  206.17,117.78 90 top
JP4  214.81,117.78 90 top
JP5  223.45,117.78 90 top
JP6  232.34,117.78 90 top
JP7  240.72,117.78 90 top
JP8  248.85,230.3 180 top
JP9  186.87,131.5 240 top
JP_5VSIG  87.86,190.47 210 top
JP_GND_5VSIG  103.78,199.75 210 top
LED1  68.7,188.36 300 top
LED2  176.53,63.32 150 top
LED3  222.87,274.93 60 top
LED4  419.11,171.8 216 top
LED5  429.86,127.19 150 top
LED6  457.06,65.62 150 top
P-UP_SCL  [1X02']  217.42,95.21 240 top
P-UP_SDA  [1X02']  209.68,87.08 60 top
PWR_RP2  212.51,276.25 0 top
R1  178.81,59.88 240 top
R2  230.01,265.13 90 top
R3  76.33,181.64 30 top
R4  216.97,81.9 240 top
R5  104.88,176.57 210 top
R6  93.88,170.22 30 top
R7  216.13,85.16 240 top
R8  91.23,124.07 240 top
R9  106.84,130.07 240 top
R10  102.18,127.27 240 top
R19  411.84,180.38 126 top
R20  417.29,130.23 210 top
REGU_3V3  181.54,187.63 180 top
RP2  248.12,265.53 180 top
SRV0  163.59,132.19 240 top
SRV1  154.8,137.27 240 top
SRV2  146,142.35 240 top
SRV3  137.2,147.37 240 top
SRV4  156.71,119.81 240 top
SRV5  147.58,125.23 240 top
SRV6  139.15,129.95 240 top
SRV7  130.3,134.53 240 top
SRV8  148.64,105.57 240 top
SRV9  139.17,110.98 240 top
SRV10  131.04,115.73 240 top
SRV11  122.24,120.81 240 top
SRV12  140.1,90.9 60 top
SRV13  131.25,96.14 60 top
SRV14  122.4,101.39 60 top
SRV15  114.22,106.63 60 top
SV1  256.09,143.02 75 top
SV2  255.1,80.79 45 top
SV3  204.59,38.99 165 bottom
SV4  147.6,76.08 345 top
SV5  105.82,97.71 315 top
SV6  53.31,130.09 285 top
SV7  47.14,193.58 255 top
SV8  102.48,226.17 225 top
SV9  142.84,249.88 195 top
SV9-1  139.18,263.77 195 top
SV10  196.88,279.32 165 top
SV11  255.24,253.93 135 top
SV12  254.66,189.63 105 top
U1  196.4,54.91 60 top
U$1  175.69,87.3 150 top
U$2  126.88,189.27 30 top
U$3  -2.8,189.52 150 bottom
U$4  369.2,149.85 198 bottom
U$5  122.37,38.53 0 top
U$6  417.4,164.03 331 bottom
U$7  13,111.58 0 top
U$8  427.66,119.07 330 bottom
U$9  461.16,74.56 30 bottom
U$10  451.3,112.2 210 bottom
U$11  326.88,183.5 150 bottom
U$12  446.46,82.98 210 bottom
U$13  19,80.58 0 top

### Tracks (layer width: path | path; a pad name or v marks a point on that pad's centre or on a via)
5V_PRP1
  Bottom 0.813: LED2.A U1.D13
5V_PWR  (via drill 0.9)
  Top 1.422: v81.97,156.9 v123.55,133.79
  Bottom 1.016: SRV12.2 SRV13.2 SRV14.2 SRV15.2 111.37,108.49 110.77,110.63 117.87,123.46 123.14,133 125.41,137.1 132,149.02 134.14,149.28 SRV3.2 SRV2.2 SRV1.2 SRV0.2 | SRV11.2 SRV10.2 SRV9.2 SRV8.2 | SRV4.2 SRV5.2 SRV6.2 SRV7.2
  Bottom 1.422: 5V_SAL.1 71.3,164.77 70.79,161.98 73.33,157.4 v81.97,156.9 | v123.55,133.79 123.62,133.78 123.14,133 | SRV7.2 125.41,137.1 | SRV11.2 117.87,123.46
5V_SIG  (via drill 0.7, 0.8, 0.9)  (5 unrouted)
  Top 0.61: v85.27,106.6 93.14,119.3 92.38,123.88
  Top 0.813: 169.09,77.39 162.23,65.96
  Top 1.016: R5.1 89.31,179.39 85.57,179.91 C4.+ | 92.38,123.88 88.32,126.16 67.49,139.12 68.51,156.39 64.44,164.26 67.24,169.6 84.76,177.72 85.84,179.44 | 169.09,77.39 169.6,78.92 v169.09,81.71 | 162.23,65.96 v144.96,60.88 | RP2.2 239.7,209.47 233.61,206.43 178.49,206.43 | 178.49,206.43 172.65,206.43 U$2.5 | v241.48,220.65 185.35,220.65 178.49,213.79 178.49,206.43
  Top 1.27: C4.+ 85.84,179.44 85.57,179.91
  Bottom 0.813: 249.35,223.7 248.85,227.25 JP8.2 248.85,232.33 250.12,234.62 JP2.2
  Bottom 1.016: JP_5VSIG.3 JP_5VSIG.2 JP_5VSIG.1 | 5V_SIG.2 74.6,198.04 | 93.14,208.97 5V_SIG2.2 | v144.96,60.88 116.46,76.65 | JP9.2 189.92,129.97 190.68,126.45 187.6,117.81 187.09,114.75 190.68,112.7 194.54,110.52 | 194.54,110.52 195.76,112.45 U1.5V | 194.54,110.52 196.84,103.16 196.78,99.24 173.92,82.22 169.93,81.94 v169.09,81.71 | 249.35,223.7 249.35,222.43 247.58,220.65 v241.48,220.65
  Bottom 1.27: JP_5VSIG.3 87.62,183.75 C4.+ | U$2.5 167.75,215.09 165.18,221.78 161.69,222.33 113.81,195.38 R5.1 | LED1.A 5V_SIG.2 | 74.6,198.04 75.11,200.84 80.7,203.63 83.25,205.08 | 83.25,205.08 90.6,209.47 93.14,208.97 | 83.25,205.08 5V_SIG3.2 JP_5VSIG.1 | v85.27,106.6 86.29,99.75 116.26,76.63 116.46,76.65 131.24,78.16 JP1.2
5V_SONARS  (via drill 0.8)
  Top 0.813: v187.63,279.07 155.37,274.24 147.75,266.62 152.07,249.1 150.29,245.54 v137.85,241.99 115.75,227.51 114.73,227.51 110.16,233.35 110.16,235.64 CON_I2C_SONARS.4
  Bottom 0.813: SV12.5 251.13,193.98 248.34,190.17 248.34,153.09 254.43,148.01 | 254.43,148.01 SV1.5 | 254.43,148.01 248.08,144.45 248.08,125.91 258.75,92.38 SV2.5 255.77,87.3 249.86,87.3 211.24,40.3 SV3.5 209.5,41.3 207.7,43.87 168.93,54.53 SV4.5 153.09,76.38 152.58,80.7 147.25,83.74 142.17,84 114.73,100 112.66,100.9 | 112.66,100.9 111.18,95.94 SV5.5 | 112.66,100.9 107.37,105.84 104.83,111.94 SV6.5 63.17,130.23 68.76,140.39 51.68,189.61 | SV7.5 49.2,187.88 51.68,189.61 | 51.68,189.61 SV8.5 103.81,219.63 v137.85,241.99 138.38,245.03 138.61,246.3 SV9.5 SV9-1.5 | v187.63,279.07 SV10.5 192.46,282.37 196.01,286.18 246.81,286.18 252.66,281.61 252.66,259.51 SV11.5
5VI2CARDU
  Bottom 1.27: CON_I2CARDU.4 CON_I2CARDU_1.4 JP9.3
5VI2CRP2
  Bottom 0.813: JP8.3 CON_I2CRP2_2.4 CON_I2CRP2.4
5VSIG_SERVOS
  Top 0.813: 177.11,86.49 R7.P$2
  Top 1.016: U$1.P20 177.11,86.49
  Bottom 0.813: R7.P$2 R4.P$2 CON_I2C_SERVOS.4
5VUARTRP2
  Bottom 0.813: JP2.1 CON_UARTRP2.4
+12V  (1 unrouted)
  Bottom 1.016: U$2.1 124.09,178.86 C3.+ 94.06,158.62 | 12V_BOARDS1.1 68.63,134.03 71.42,134.54 78.44,130.49 76.52,126.97 76.28,126.74 12V_SIG_BOARDS.1
  Bottom 1.27: 78.44,130.49 81.97,128.45 84,129.46 94.41,145.72 94.06,158.62
ARD_RX  (1 unrouted)
  Top 0.813: U1.RX 148.77,85.27 138.86,85.27 124.39,93.4 119.31,92.13 CON_UARTARDU.1
ARD_TX  (1 unrouted)
  Top 0.813: U1.TX 151.56,81.2 148.01,83.24 144.96,83.24 138.61,83.49 124.64,91.36 121.08,90.6 CON_UARTARDU.2
BAT_12V_BOARDS+
  Bottom 1.27: 409.63,123.88 BAT_12V_BOARDS.1
  Bottom 1.422: 392.86,124.38 BAT_12V_BOARDS.1 | U$8.P$1 409.63,123.88
BAT_12V_BOARDS-
  Bottom 1.422: R20.P$2 395.91,128.96 388.04,124.64 387.02,121.59 399.41,100.91 | 399.41,100.91 390.07,116.51 395.4,119.56 BAT_12V_BOARDS.2 | 414.2,96.7 411.21,95.36 | 411.21,95.36 399.41,100.91 | 12V_BOARDS_SRC.2 411.21,95.36
BAT_12V_PROPU+
  Bottom 1.27: BAT_12V_PROPU.1 349.86,158.28 U$4.P1
BAT_12V_PROPU-
  Bottom 1.27: BAT_12V_PROPU.2 12V_PWR_SRC.2
  Bottom 1.422: R19.P$2 12V_PWR_SRC.2
BOARDIHM_GND
  Bottom 1.422: U$9.P$2 453.57,85.78 455.09,88.82 BOARDIHM_CON_IHM.3 457.63,93.4 459.16,96.19 U$10.P$2 | LED6.2 458.65,68.25 453.32,72.06 U$9.P$2 | U$12.P$2 U$9.P$2
GND  (via drill 0.8, 0.9)  (14 unrouted)
  Top 0.813: v117.02,237.41 121.08,248.08 v146.55,255.72 | C1.2 183.82,195.25 181.28,192.71 REGU_3V3.2
  Top 1.016: R6.1 93.91,155.12 v107.37,146.99 118.29,147.75 124.64,144.45 124.17,141.26 v122.83,138.62 | v117.02,237.41 114.99,239.95 111.94,240.46 66.73,209.98 64.19,200.84 76.13,185.85 R3.P$2 | RP2.6 234.67,209.77 234.11,209.22 214.05,209.22 v213.79,208.97 | U$1.P1 185.09,98.98 U1.GND@0
  Top 1.27: JP6.2 235.64,119.05 236.65,118.03 236.65,114.99 238.43,113.21 245.04,113.21 252.4,118.54 255.45,121.88 v255.49,124.37
  Bottom 0.61: 184.58,70.03 U1.GND@2
  Bottom 0.813: SRV7.1 SRV6.1 | SV12.1 255.96,157.15 263.32,151.56 263.64,144.91 257.99,138.1 SV1.1 255.2,124.89 255.32,124.67 | v255.49,124.37 266.88,94.92 266.88,82.22 260.78,75.87 253.16,75.87 SV2.1 249.61,76.38 212.59,31.67 202.36,31.67 199.69,36.38 SV3.1 162.33,49.35 141.91,74.6 SV4.1 140.9,79.43 129.72,85.78 129.48,85.72 127.69,85.27 125.4,81.2 116.26,79.93 99.24,92.63 99.75,98.98 SV5.1 100,105.33 51.49,118.54 47.68,121.34 46.15,128.45 49.96,134.54 SV6.1 53.77,135.81 61.14,143.18 49.71,175.95 37.52,187.12 39.8,195.25 46.92,198.81 SV7.1 52.5,198.3 100.51,231.83 104.57,231.06 SV8.1 CON_I2C_SONARS.3 v117.02,237.41 | SV9.1 v146.55,255.72 SV9-1.1 148.26,267.13 193.73,273.48 200.33,274.24 200.41,274.34 201.6,275.77 SV10.1 | 12V_PWR_BOARD.2 C2.2 179.76,185.6 181.54,187.38 REGU_3V3.2 | 3V3_PWR2.1 116.51,212.78
  Bottom 1.016: SRV2.1 147.77,144.26 | 147.77,144.26 SRV1.1 SRV0.1 | SRV0.1 167.07,133.12 169.66,128.98 163.78,118.48 | SRV11.1 SRV10.1 SRV9.1 SRV8.1 153.91,105.56 156.9,106.35 163.78,118.48 | SRV12.1 SRV13.1 SRV14.1 SRV15.1 108.89,107.56 107.96,111.37 121.8,136.86 v122.83,138.62 129.74,151.49 133.88,152.08 SRV3.1 147.77,144.26 | 91.05,170.04 R6.1 | SRV6.1 SRV5.1 SRV4.1 163.78,118.48 | JP_GND_5VSIG.1 JP_GND_5VSIG.2 JP_GND_5VSIG.3 C4.- | CON_UARTARDU.3 122.86,88.06 124.64,88.57 129.48,85.72 | U1.GND@2 181.74,64.83 R1.P$1 | 180.93,148.3 185.35,145.97 185.09,143.43 CON_I2CARDU.3 | 180.93,148.3 180.52,148.51 169.6,142.93 SRV0.1 | CON_I2C_SERVOS.3 221.67,77.9 221.79,77.51 | 221.79,77.51 222.43,75.36 220.91,72.82 218.37,72.82 199.32,81.46 184.58,70.03 | v255.49,124.37 255.32,124.67 | 244.53,117.27 244.78,114.99 224.46,78.16 221.79,77.51 | CON_UARTRP2.3 255.45,246.81 SV11.1 263.32,246.05 263.32,211.51 258.75,206.93 258.75,186.87 257.74,185.34 SV12.1 | PWR_RP2.4 211.25,271.2 203.38,271.2 200.41,274.34 | 12V_PWR_BOARD.2 179.05,150.18 180.93,148.3 | v213.79,208.97 212.52,208.97 208.97,206.43 192.46,206.43 188.39,203.12 188.39,195.5 C1.2
  Bottom 1.27: 5V_SAL.2 79.63,164.13 R6.1 94.4,166.74 112.2,176.94 117.14,192.91 U$2.6 | 91.05,170.04 C4.- 82.94,176.88 R3.P$2 5V_SIG.1 | 5V_SIG2.1 100.37,206.36 | 100.37,206.36 JP_GND_5VSIG.2 | 5V_SIG3.1 91.11,200.84 JP_GND_5VSIG.3 | IHM.3 v107.37,146.99 | CON_I2CARDU.3 CON_I2CARDU_1.3 | U1.GND@1 U1.GND@0 196.78,119.05 JP3.2 JP4.2 JP5.2 JP6.2 JP7.2 243,118.8 244.53,117.27 | 3V3_PWR2.1 100.37,206.36 | 116.51,212.78 120.07,212.27 127,216.2 | 127,216.2 135.31,220.9 135.82,223.19 3V3_PWR1.1 | 3V3_PWR.1 127,216.2 | v146.55,255.72 12V_PWR_BOARD2.2 156.9,259.51 158.42,263.32 163.5,266.12 166.04,265.61 12V_PWR_BOARD1.2
GND1
  Bottom 0.813: CON_I2CRP2_2.3 CON_I2CRP2.3
  Bottom 1.016: CON_I2CRP2.3 239.7,253.92 R2.P$1
GND_12
  Bottom 1.016: 97.61,157.27 C3.- 126.63,174.46 130.35,188.33 127.81,192.73 U$2.2 | 12V_BOARDS1.2 70.91,127.17 71.42,124.38 77.01,121.58 80.66,123.92 80.62,123.97 12V_SIG_BOARDS.2
  Bottom 1.27: 80.66,123.92 85.02,126.16 97.97,146.23 97.61,157.27
N$1  (1 unrouted)
  Top 0.813: CON_UARTARDU.4 JP1.1
N$2
  Bottom 1.016: LED2.K 174.17,60.88 R1.P$2
N$3  (1 unrouted)
  Bottom 0.813: 230.05,272.97 R2.P$2
  Bottom 1.016: 230.05,272.97 LED3.K
N$4  (1 unrouted)
  Bottom 1.016: R6.2 R5.2 111.1,202.4 U$2.7
N$5
  Bottom 0.813: R4.P$1 212.98,88 P-UP_SDA.2
N$6
  Bottom 1.422: U$9.P$1 469.06,74.6 BOARDIHM_CON_IHM.1
N$7
  Bottom 1.27: LED1.K R3.P$1
N$8
  Bottom 1.27: U$4.P2 390.83,146.48 405.82,154.86 U$6.P$1
N$9
  Bottom 0.813: R7.P$1 214.81,90.35 213.79,91.11 213.29,92.89 214.81,95.17 216.33,95.68 P-UP_SCL.1
N$11
  Top 2.184: 342.19,254.04 350.85,249.04
N$12
  Bottom 1.422: LED4.K R19.P$1
N$14
  Bottom 1.422: U$8.P$2 LED5.A 432.23,124.64 431.47,118.03 423.09,112.7 418.05,109.72 415.98,108.64 414.71,107.87 12V_BOARDS_SRC.1
N$15
  Bottom 1.422: LED6.1 460.52,62.6 469.06,66.47 472.87,73.84 462.46,87.81 459.67,89.59 457.89,88.82 BOARDIHM_CON_IHM.2
N$16
  Bottom 1.422: LED5.K R20.P$1
N$17
  Top 0.61: R9.P$2 105.59,123.62 92.13,103.05 93.14,96.7 133.53,74.09 136.83,73.58 140.13,79.68 142.42,80.19 153.09,77.39 155.37,77.39 U1.D3
N$18
  Bottom 1.422: BOARDIHM_CON_IHM.4 453.82,91.62 454.33,92.89 453.82,98.73 U$10.P$1
N$19
  Top 2.184: 35.21,279.18 43.87,274.18
N$20
  Top 2.184: 52.53,269.18 69.85,259.18
N$21
  Top 2.184: 78.51,254.18 87.17,249.18
N$22
  Top 2.184: 66.19,272.84 56.19,255.52
N$23
  Top 2.184: 71.19,281.5 76.19,290.16
N$24
  Top 2.184: 51.19,246.86 46.19,238.2
N$25
  Bottom 2.184: 71.19,281.5 66.19,272.84
N$26
  Bottom 2.184: 43.87,274.18 52.53,269.18
N$27
  Bottom 2.184: 69.85,259.18 78.51,254.18
N$28
  Bottom 2.184: 56.19,255.52 51.19,246.86
N$29
  Top 2.184: 48.56,69.13 57.22,64.13
N$30
  Top 2.184: 65.88,59.13 83.2,49.13
N$31
  Top 2.184: 91.86,44.13 100.52,39.13
N$32
  Top 2.184: 79.54,62.79 69.54,45.47
N$33
  Top 2.184: 84.54,71.45 89.54,80.11
N$34
  Top 2.184: 64.54,36.81 59.54,28.15
N$35
  Bottom 2.184: 84.54,71.45 79.54,62.79
N$36
  Bottom 2.184: 57.22,64.13 65.88,59.13
N$37
  Bottom 2.184: 83.2,49.13 91.86,44.13
N$38
  Bottom 2.184: 69.54,45.47 64.54,36.81
N$39
  Top 0.61: U1.D5 157.66,71.3 145.98,68 134.29,69.52 89.59,94.67 87.56,104.57 R10.P$2
N$40
  Bottom 1.27: U$6.P$2 419.03,168.33 421.31,169.85 LED4.A 410.97,187.4 12V_PWR_SRC.1
N$41  (1 unrouted)
  Bottom 1.27: IHM.6 R9.P$1
N$42
  Bottom 0.813: RP2.7 232.08,251.13 222.18,260.53 LED3.A
N$43  (1 unrouted)
  Bottom 1.27: IHM.5 R10.P$1
N$44  (1 unrouted)
  Bottom 1.27: IHM.2 97.45,134.48 R8.P$1
N$45
  Top 0.61: U1.D6 159.18,69.52 146.23,66.22 134.29,67.49 84.25,95.43 82.22,110.16 R8.P$2
N$46  (via drill 0.7)  (1 unrouted)
  Top 0.61: U1.D7 161.13,67.91 146.48,64.44 133.78,65.71 81.71,94.16 79.43,111.18 v85.02,120.57
  Bottom 1.27: IHM.1 v85.02,120.57
N$47  (via drill 0.7)  (1 unrouted)
  Top 0.61: U1.D4 155.88,72.31 145.47,69.77 135.05,71.3 91.62,95.43 89.84,103.56 103.56,124.64 100.76,130.48 v103.56,134.8
  Bottom 1.27: v103.56,134.8 IHM.4
N$48
  Top 2.184: 359.51,244.04 376.83,234.04
N$49  (via drill 0.7)
  Top 0.61: U1.D2 153.09,79.17 142.93,81.71 139.12,80.95 136.07,75.87 133.02,76.38 94.67,97.71 94.16,102.54 101.53,113.72 105.59,115.24 111.94,126.16 v111.69,129.46
  Bottom 0.61: v111.69,129.46 111.69,129.97
  Bottom 1.27: IHM.7 111.18,132.77 v111.69,129.46
N$51
  Bottom 1.422: LED6.3 453.82,65.46 438.58,74.09 433,85.01 440.11,97.71 445.44,100.25 451.28,96.95 451.54,92.89 BOARDIHM_CON_IHM.5
N$52
  Bottom 1.422: LED6.4 441.89,75.11 436.3,85.27 442.14,95.43 445.7,97.21 449,95.43 449,93.4 BOARDIHM_CON_IHM.6
N$53
  Top 2.184: 385.49,229.04 394.15,224.04
N$54
  Top 2.184: 373.17,247.7 363.17,230.38
N$55
  Top 2.184: 378.17,256.36 383.17,265.02
N$56
  Top 2.184: 358.17,221.72 353.17,213.06
N$57
  Bottom 2.184: 378.17,256.36 373.17,247.7
N$58
  Bottom 2.184: 350.85,249.04 359.51,244.04
N$59
  Bottom 2.184: 376.83,234.04 385.49,229.04
N$60
  Bottom 2.184: 363.17,230.38 358.17,221.72
N$61
  Top 2.184: 419.66,37.89 428.32,32.89
N$62
  Top 2.184: 436.98,27.89 454.3,17.89
N$63
  Top 2.184: 462.96,12.89 471.62,7.89
N$64
  Top 2.184: 450.64,31.55 440.64,14.23
N$65
  Top 2.184: 455.64,40.21 460.64,48.87
N$66
  Top 2.184: 435.64,5.57 430.64,-3.09
N$67
  Bottom 2.184: 455.64,40.21 450.64,31.55
N$68
  Bottom 2.184: 428.32,32.89 436.98,27.89
N$69
  Bottom 2.184: 454.3,17.89 462.96,12.89
N$70
  Bottom 2.184: 440.64,14.23 435.64,5.57
N$72
  Bottom 0.813: C2.1 REGU_3V3.3
  Bottom 1.27: C2.1 173.41,230.81 168.33,236.65 152.58,236.65 3V3_PWR1.2 137.09,230.81 134.55,232.59 126.19,227.9 | 126.19,227.9 118.04,223.44 118.29,220.14 3V3_PWR2.2 | 3V3_PWR.2 126.19,227.9
N$73
  Bottom 1.422: BOARDIHM_CON_IHM.7 443.92,89.08 U$12.P$1
N$74
  Bottom 0.813: 12V_PWR_BOARD.1 REGU_3V3.1 C1.1
  Bottom 1.27: 12V_PWR_BOARD1.1 174.08,262.05 | 174.08,262.05 178.23,255.19 178.23,197.28 183.82,192.96 REGU_3V3.1 | 12V_PWR_BOARD2.1 163.5,258.24 167.31,257.99 174.08,262.05
PRESENCE_1
  Bottom 0.61: JP3.1 208.71,108.89 206.43,105.08 170.61,76.38 U1.D8
PRESENCE_2
  Bottom 0.61: JP4.1 211.25,109.4 208.21,104.06 172.65,74.85 U1.D9
PRESENCE_3
  Bottom 0.61: JP5.1 212.52,107.62 209.73,102.54 174.94,73.74 U1.D10
PRESENCE_4
  Bottom 0.61: JP6.1 214.3,106.86 211.25,101.27 177.22,72.31 U1.D11
PRESENCE_5
  Bottom 0.61: JP7.1 219.64,104.32 216.84,98.73 179.25,70.79 U1.D12
PWM0  (via drill 0.8)
  Top 0.813: v166.15,128.13 168.84,126.88 172.22,125.15 175.56,119.55
  Top 1.016: 175.56,119.55 180.77,101.52 U$1.P2
  Bottom 1.27: SRV0.3 v166.15,128.13
PWM1  (via drill 0.8)
  Top 0.813: v156.58,132.87 157.91,129.87 165.9,125.21 165.98,121.86 173.64,117.54
  Top 1.016: U$1.P3 178.23,102.29 173.64,117.54
  Bottom 1.27: SRV1.3 v156.58,132.87
PWM2  (via drill 0.8)
  Top 0.813: v147.92,138.2 149.92,132.87 164.24,124.21 164.57,120.87 171.55,116.71
  Top 1.016: 171.55,116.71 175.69,103.56 U$1.P4
  Bottom 1.27: SRV2.3 v147.92,138.2
PWM3  (via drill 0.8)
  Top 0.813: v139.26,143.19 141.92,135.53 162.57,123.21 162.98,120.04 169.12,116.4
  Top 1.016: U$1.P5 173.41,104.32 169.12,116.4
  Bottom 1.27: SRV3.3 v139.26,143.19
PWM4  (via drill 0.8)
  Top 0.813: v158.83,115.81 163.38,115.95 167.79,113.46
  Top 1.016: 167.79,113.46 171.12,105.33 U$1.P6
  Bottom 1.016: SRV4.3 v158.83,115.81
PWM5  (via drill 0.8)
  Top 0.813: 150.58,117.22 158.24,112.89 162.87,113.79 166.2,111.8
  Top 1.016: v149.25,121.22 150.58,117.22 | U$1.P7 168.58,105.84 166.2,111.8
  Bottom 1.016: SRV5.3 v149.25,121.22
PWM6  (via drill 0.8)
  Top 0.813: 142.59,119.55 157.91,110.89 161.52,111.8 164.85,110.05
  Top 1.016: v140.93,125.88 142.59,119.55 | U$1.P8 166.3,106.6 164.85,110.05
  Bottom 1.016: SRV6.3 v140.93,125.88
PWM7  (via drill 0.8)
  Top 0.813: 133.6,122.55 157.91,108.89 161.01,109.8 163.5,108.39
  Top 1.016: v132.27,130.54 133.6,122.55 | U$1.P9 163.76,107.62 163.5,108.39
  Bottom 1.016: SRV7.3 v132.27,130.54
PWM8  (via drill 0.8)
  Top 0.813: v150.58,101.9 156.01,103.76 159.37,105.51
  Top 1.016: 159.37,105.51 U$1.P10
  Bottom 0.813: SRV8.3 v150.58,101.9
PWM9  (via drill 0.8)
  Top 0.61: 143.4,103 150.25,99.32
  Top 0.813: v141.59,106.9 143.4,103 | 150.25,99.32 154.89,99.28
  Top 1.016: U$1.P11 154.89,99.28
  Bottom 1.016: SRV9.3 v141.59,106.9
PWM10  (via drill 0.8)
  Top 0.61: 133.85,106.36 150.58,97.4
  Top 0.813: v133.27,111.56 133.85,106.36 | 150.58,97.4 155.52,96.46 157.23,96.24 U$1.P12
  Bottom 0.813: SRV10.3 v133.27,111.56
PWM11  (via drill 0.8)
  Top 0.61: 126.06,108.55 150.84,95.48
  Top 0.813: v124.28,116.89 126.06,108.55 | 150.84,95.48 158.74,94.54 158.92,94.58 U$1.P13
  Bottom 0.813: SRV11.3 v124.28,116.89
PWM12
  Top 0.813: SRV12.3 154.1,86.03 166.8,86.54 U$1.P17
PWM13
  Top 0.61: 136.07,98.22 153.6,88.82
  Top 0.813: SRV13.3 136.07,98.22 | 153.6,88.82 165.03,88.82 U$1.P16
PWM14
  Top 0.61: 128.45,103.81 153.09,90.86
  Top 0.813: SRV14.3 128.45,103.81 | 153.09,90.86 163.25,90.86 U$1.P15
PWM15
  Top 0.61: 151.82,93.4 121.34,109.4
  Top 0.813: U$1.P14 160.96,92.63 151.82,93.4 | 121.34,109.4 SRV15.3
RP2_PWR
  Bottom 0.813: RP2.26 209.22,210.24 206.17,208.2 184.08,208.2 181.54,210.24 181.54,218.36 219.13,272.47 219.13,277.04 PWR_RP2.2
RX_RP2
  Bottom 0.813: RP2.10 229.54,208.46 236.91,207.19 251.39,207.19 260.28,212.27 CON_UARTRP2.1
SCL_ARDU  (1 unrouted)
  Bottom 1.016: CON_I2CARDU_1.1 173.92,132.51 U1.A5
  Bottom 1.27: CON_I2CARDU.1 CON_I2CARDU_1.1 | CON_I2CARDU_1.1
SCL_RP1
  Bottom 0.813: RP2.5 CON_I2CRP2_2.1 CON_I2CRP2.1
SCL_SERVOS
  Top 0.813: 172.39,91.87 177.22,91.87 181.28,90.09 213.79,94.16 P-UP_SCL.2
  Top 1.016: 172.39,91.87 U$1.P18
  Bottom 0.813: P-UP_SCL.2 217.35,92.13 219.89,90.6 CON_I2C_SERVOS.1
SCL_SONARS  (via drill 0.8)
  Top 0.813: v122.1,251.64 v140.92,257.16
  Bottom 0.813: SV12.3 252.91,189.15 251.89,188.14 251.89,155.12 254.43,153.09 258.5,153.09 261.8,150.55 261.8,145.72 258.5,142.42 SV1.3 254.43,142.93 251.64,141.66 251.64,126.67 264.34,92.38 264.34,82.73 261.04,79.43 256.72,79.43 SV2.3 253.41,82.22 251.39,82.22 211.76,34.21 206.94,34.21 204.59,38.33 SV3.3 204.59,39.35 203.63,41.07 164.01,51.99 146.99,72.82 SV4.3 148.26,78.16 147.75,79.68 146.23,80.44 142.93,80.44 120.32,93.14 116.77,93.65 113.46,88.82 108.89,87.81 103.05,92.38 105.84,97.71 | 105.84,97.71 SV5.3 | 105.84,97.71 107.11,98.98 107.88,100.25 101.27,107.37 52.25,120.57 49.46,122.61 48.69,126.42 50.73,129.46 SV6.3 60.38,134.29 64.19,140.64 51.74,176.71 40.06,187.88 41.33,192.71 44.88,194.23 SV7.3 49.46,192.96 98.22,228.02 100.76,227.76 SV8.3 103.56,224.71 104.83,224.71 CON_I2C_SONARS.2 122.1,237.66 v122.1,251.64 | SV9.3 v140.92,257.16 SV9-1.3 138.86,265.35 140.64,267.64 192.46,275.51 196.01,276.28 SV10.3 197.54,281.36 198.55,282.12 235.64,282.12 239.7,279.07 239.7,258.5 249.1,252.65 253.93,252.65 SV11.3
SDA_ARDU  (2 unrouted)
  Bottom 1.016: CON_I2CARDU_1.2 176.46,131.75 177.22,125.91 U1.A4
  Bottom 1.27: CON_I2CARDU.2 CON_I2CARDU_1.2
SDA_RP1
  Bottom 0.813: RP2.3 CON_I2CRP2_2.2 CON_I2CRP2.2
SDA_SERVOS
  Top 0.813: 174.17,89.84 177.22,89.84 182.04,87.81 207.7,88.06 P-UP_SDA.1
  Top 1.016: 174.17,89.84 U$1.P19
  Bottom 0.813: P-UP_SDA.1 CON_I2C_SERVOS.2
SDA_SONARS  (via drill 0.8)
  Top 0.813: v126.42,255.7 v137.8,259.06
  Bottom 0.813: SV12.4 252.15,191.44 250.12,189.15 250.12,154.36 253.93,151.05 258.24,151.05 260.28,149.53 260.28,146.74 259.01,145.47 SV1.4 254.94,145.47 249.86,143.18 249.86,126.16 262.05,91.62 262.05,83.49 260.28,81.46 257.99,81.46 SV2.4 253.7,85.01 250.62,85.01 211.25,37.01 207.95,37.01 207.05,38.93 SV3.4 207.05,40.71 205.92,42.34 167.06,53.01 149.53,73.33 SV4.4 150.55,77.39 149.53,80.44 146.23,82.22 142.67,82.22 119.81,95.17 115.5,95.68 112.19,90.86 109.15,90.09 105.84,92.63 107.37,95.68 | 107.37,95.68 SV5.4 | 107.37,95.68 110.42,100.25 106.1,104.57 103.3,109.14 52.5,122.61 51.49,123.37 50.98,125.4 52,126.92 SV6.4 61.9,132.77 66.47,140.39 53.52,177.72 42.34,188.14 43.11,191.19 44.12,191.69 SV7.4 49.46,190.42 95.68,223.7 97.97,225.48 98.99,225.48 SV8.4 102.03,222.68 104.57,222.43 CON_I2C_SONARS.1 126.42,237.67 v126.42,255.7 | SV9.4 v137.8,259.06 SV9-1.4 136.32,264.85 139.12,269.16 191.44,277.29 193.73,277.8 SV10.4 195.25,282.63 197.03,284.15 245.29,284.15 250.37,280.09 250.37,261.54 248.59,258.24 248.59,255.45 250.12,254.18 251.89,254.18 SV11.4
TX_RP2
  Bottom 0.813: RP2.8 232.08,209.73 237.42,208.97 250.12,208.97 257.74,213.28 CON_UARTRP2.2

### Text on the board
Top: TOP | GND | SRV3 | SRV2 | GND | SRV1 | SRV7 | SRV0 | SRV6 | A5 | + | GND | SRV5 | + | A0 | SRV11 | SRV4 | VIN | GND | SRV10 | SRV9 | SRV8 | SRV15 | GND | SRV14 | SRV13 | P-UP_SDA | SRV12 | P-UP_SCL | D8 | D13 | GND | LED_ARDU | TOP
Bottom: BOTTOM | + | 12<->5V | BOTTOM